# EAGLE design pcb2 (EAGLE 9.6.2)
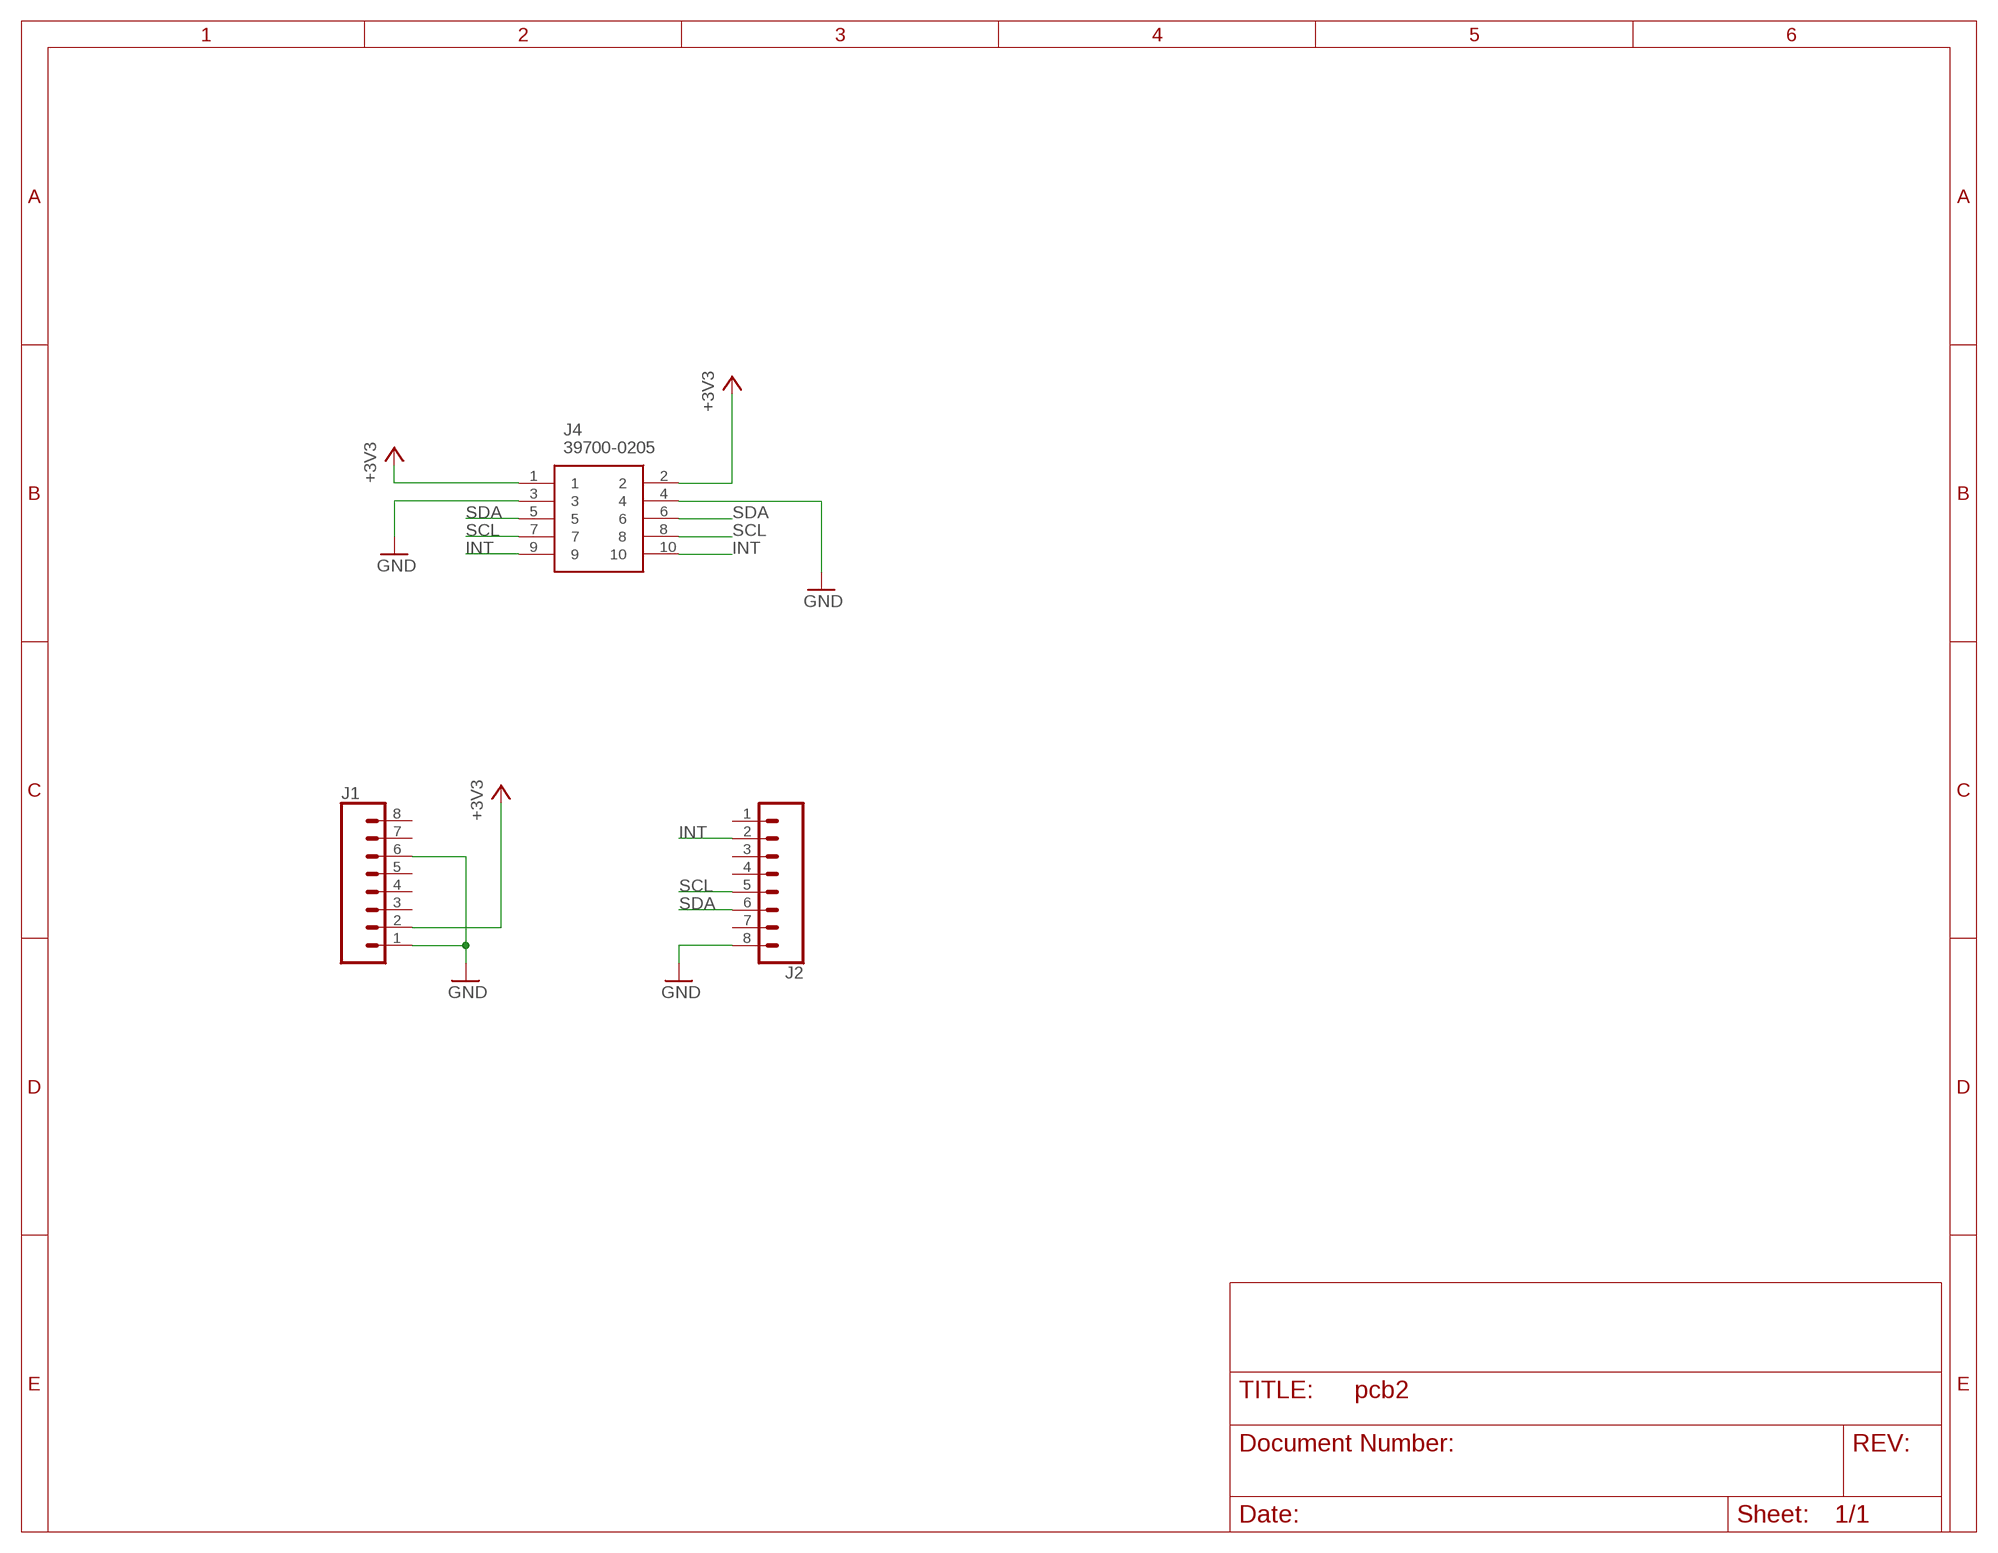
[diagram p0: schematic, sheet 1]

## Parts
J1  CONN_08"  [1X08]
J2  CONN_08"  [1X08]
J4  39700-0205  [397000205]

## Nets
+3V3: J1.2 J4.1 J4.2
GND: J1.1 J1.6 J2.8 J4.3 J4.4
INT: J2.2 J4.9 J4.10
SCL: J2.5 J4.7 J4.8
SDA: J2.6 J4.5 J4.6
Unconnected: J1.3 J1.4 J1.5 J1.7 J1.8 J2.1 J2.3 J2.4 J2.7

## Library data of the parts
J1 J2 = SparkFun-Connectors:CONN_08: Multi connection point. Often used as Generic Header-pin footprint for 0.1 inch spaced/style header connections On any of the 0.1 inch spaced packages, you can populate with these: Break Away Headers - Straight <https://www.sparkfun.com/products/116> (PRT-00116) Break Away Male Headers - Right Angle <https://www.sparkfun.com/products/553> (PRT-00553) Female Headers <https://www.sparkfun.com/products/115> (PRT-00115) Break Away Headers - Machine Pin <https://www.sparkfun.com/products/117> (PRT-00117) Break Away Female Headers - Swiss Machine Pin <https://www.sparkfun.com/products/743> (PRT-00743) Arduino Stackable Header - 8 Pin <https://www.sparkfun.com/products/9279> (PRT-09279) For SCREWTERMINALS and SPRING TERMINALS visit here: Screw Terimnals on SparkFun.com <https://www.sparkfun.com/search/results?term=Screw+Terminals> (5mm/3.5mm/2.54mm spacing) This device is also useful as a general connection point to wire up your design to another part of your project. Our various solder wires solder well into these plated through hole pads. Hook-Up Wire - Assortment (Stranded, 22 AWG) <https://www.sparkfun.com/products/11375> (PRT-11375) Hook-Up Wire - Assortment (Solid Core, 22 AWG) <https://www.sparkfun.com/products/11367> (PRT-11367) View the entire wire category on our website here <https://www.sparkfun.com/categories/141> Special notes: Molex polarized connector foot print use with SKU : PRT-08231 with associated crimp pins and housings. 1MM SMD Version SKU: PRT-10208 NOTES ON THE VARIANTS LOCK and LOCK_LONGPADS... This footprint was designed to help hold the alignment of a through-hole component (i.e. 6-pin header) while soldering it into place. You may notice that each hole has been shifted either up or down by 0.005 of an inch from it's more standard position (which is a perfectly straight line). This slight alteration caused the pins (the squares in the middle) to touch the edges of the holes. Because they are alternating, it causes a "brace" to hold the component in place. 0.005 has proven to be the perfect amount of "off-center" position when using our standard breakaway headers. Although looks a little odd when you look at the bare footprint, once you have a header in there, the alteration is very hard to notice. Also,if you push a header all the way into place, it is covered up entirely on the bottom side.; PROD_ID: CONN-08438
J4 = SamacSys_Parts:39700-0205: Fixed Terminal Blocks SPRING TERMINAL BLOCK 5C-VERT GREEN Source: Datasheet <https://componentsearchengine.com//39700-0205.pdf>; DESCRIPTION: Fixed Terminal Blocks SPRING TERMINAL BLOCK 5C-VERT GREEN; HEIGHT: 14mm; MANUFACTURER_NAME: Molex; MANUFACTURER_PART_NUMBER: 39700-0205; MOUSER_PART_NUMBER: 538-39700-0205; MOUSER_PRICE-STOCK: https://www.mouser.co.uk/ProductDetail/Molex/39700-0205?qs=iVQMhOBiFE44PbCr6CEU0w%3D%3D

## Board
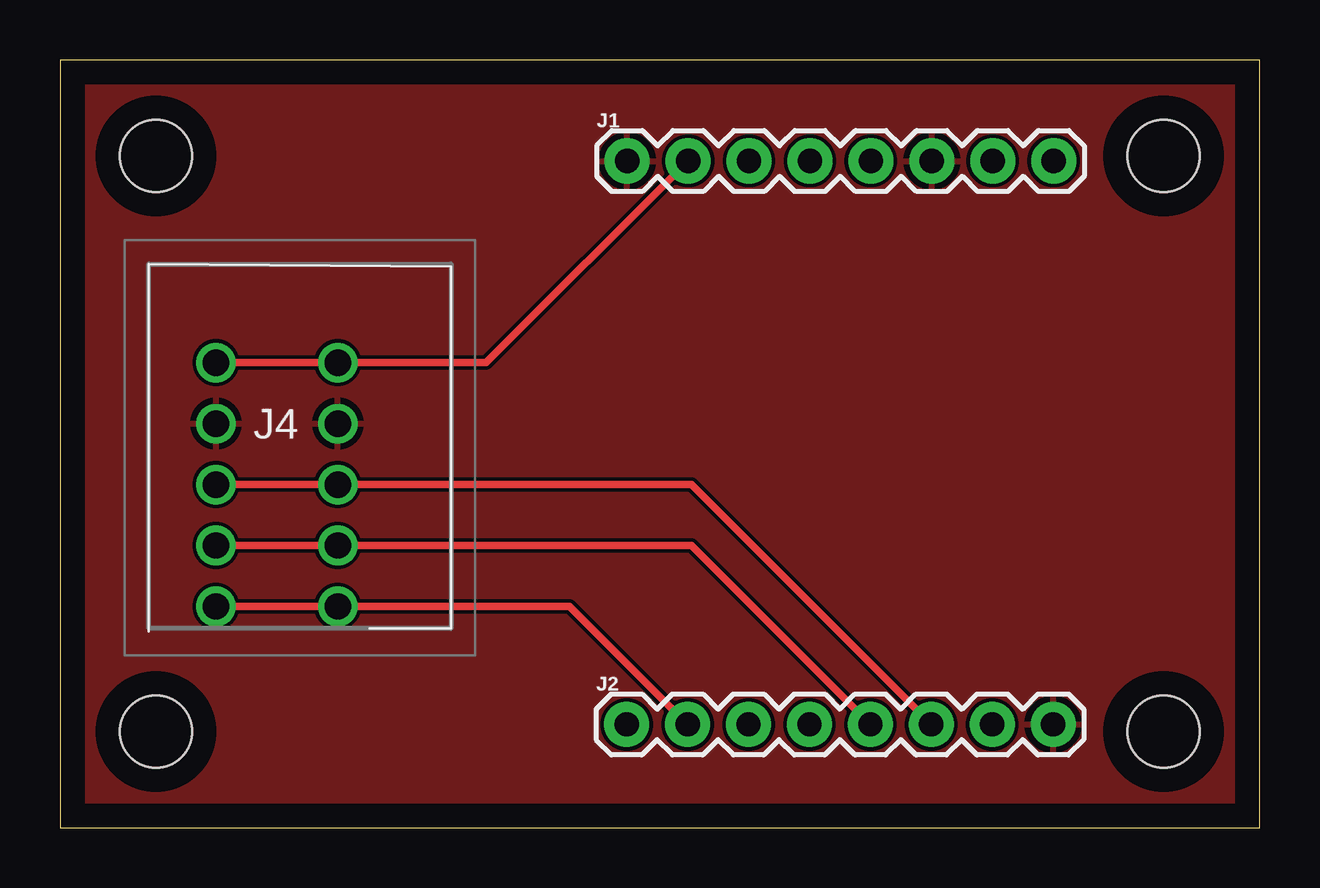
[diagram p1: board, top side]
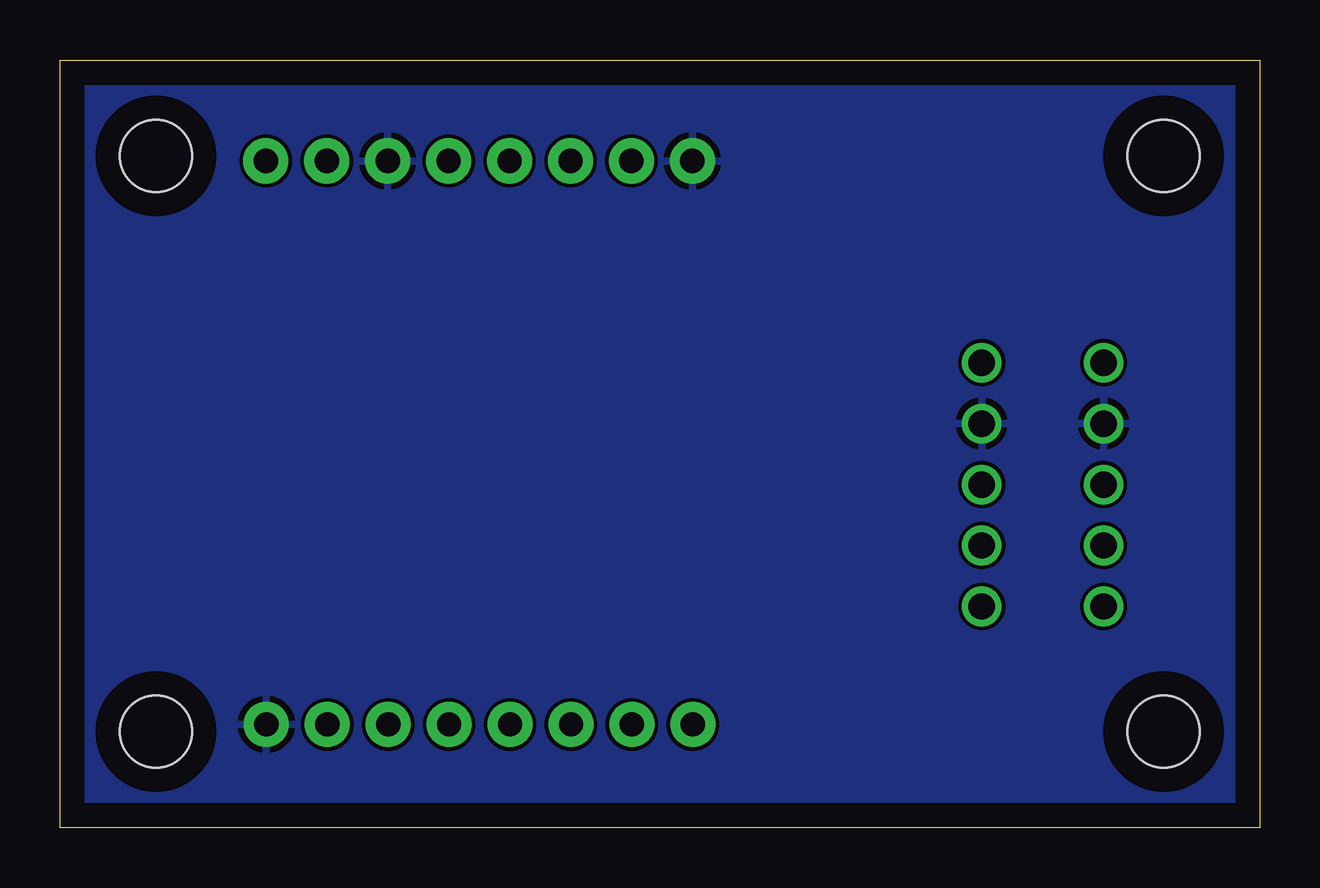
[diagram p2: board, bottom side, seen from below]

Size 50 x 32 mm. Coordinates in mm from the lower left corner, seen from the top.
Outline: 0,0 50,0 50,32 0,32 0,0
Copper layers (1*16): Top 0.035mm / dielectric 1.5mm / Bottom 0.035mm
Design rules "default": minimum track width 6mil, minimum drill 0.35mm, track to track 6mil, track to pad 6mil, pad to pad 6mil, via to via 6mil, smd to smd 6mil, copper to edge 40mil, drill to drill 6mil, minimum pad ring 10mil, minimum via ring 8mil, stop-mask expansion 4mil, vias tented up to drill 0mil, thermal gap 10mil
Holes 3 mm at 4,4 4,28 46,28 46,4

### Footprints (pad centres in the part's own frame; a part is rotated, then mirrored left to right if it is on the bottom)
1X08 = drill 1.016 pad 1.88: 1 0,0; 2 2.54,0; 3 5.08,0; 4 7.62,0; 5 10.16,0; 6 12.7,0; 7 15.24,0; 8 17.78,0
397000205 = drill 1.1 pad 1.65: 1 0,0; 2 0,5.08; 3 2.54,0; 4 2.54,5.08; 5 5.08,0; 6 5.08,5.08; 7 7.62,0; 8 7.62,5.08; 9 10.16,0; 10 10.16,5.08

### Placement (x,y rotation side)
J1  23.64,27.79 0 top
J2  23.62,4.3 0 top
J4  6.5,19.38 270 top

### Tracks (layer width: path | path; a pad name or v marks a point on that pad's centre or on a via)
+3V3
  Top 0.305: J1.2 17.77,19.38 J4.2 J4.1
GND
  pour Bottom: 0,32 50,32 50,0 0,0
  pour Top: 0,32 50,32 50,0 0,0
INT
  Top 0.305: J2.2 21.24,9.22 J4.10 J4.9
SCL
  Top 0.305: J2.5 26.32,11.76 J4.8 J4.7
SDA
  Top 0.305: J2.6 26.32,14.3 J4.6 J4.5

### Text on the board
tValues: The Cool Team 2021 | +3V3 | GND | SDA | HDC2010 | SCL | INT